# Altium schematic sheet BoardConnectors.SchDoc
size A4; SheetNumber: 3; SheetTotal: 12
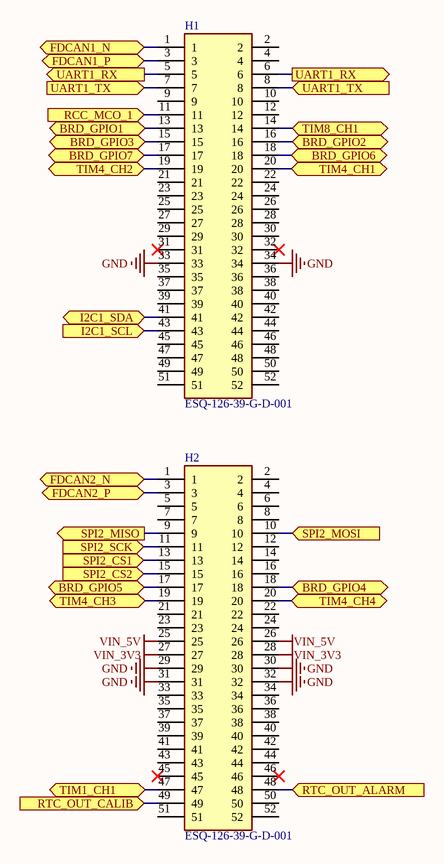
[diagram p0: BoardConnectors.SchDoc]

## Parts
H1  ESQ-126-39-G-D-001  [RHDR52W64P254_2X26_6654X495X1135P]
H2  ESQ-126-39-G-D-001  [RHDR52W64P254_2X26_6654X495X1135P]

## Ports
BRD_GPIO1 (bidir), BRD_GPIO2 (bidir), BRD_GPIO3 (bidir), BRD_GPIO4 (bidir), BRD_GPIO5 (bidir), BRD_GPIO6 (bidir), BRD_GPIO7 (bidir), FDCAN1_N (bidir), FDCAN1_P (bidir), FDCAN2_N (bidir), FDCAN2_P (bidir), I2C1_SCL (in), I2C1_SDA (bidir), RCC_MCO_1 (in), RTC_OUT_ALARM (in), RTC_OUT_CALIB (in), SPI2_CS1 (in), SPI2_CS2 (in), SPI2_MISO (out), SPI2_MOSI (in), SPI2_SCK (in), TIM1_CH1 (bidir), TIM4_CH1 (bidir), TIM4_CH2 (bidir), TIM4_CH3 (bidir), TIM4_CH4 (bidir), TIM8_CH1 (bidir), UART1_RX (out), UART1_TX (in)

## Nets
GND: H1.33 H1.34 H2.29 H2.30 H2.31 H2.32
VIN_3V3: H2.27 H2.28
VIN_5V: H2.25 H2.26
BRD_GPIO1: H1.13 ; port BRD_GPIO1
BRD_GPIO2: H1.16 ; port BRD_GPIO2
BRD_GPIO3: H1.15 ; port BRD_GPIO3
BRD_GPIO4: H2.18 ; port BRD_GPIO4
BRD_GPIO5: H2.17 ; port BRD_GPIO5
BRD_GPIO6: H1.18 ; port BRD_GPIO6
BRD_GPIO7: H1.17 ; port BRD_GPIO7
FDCAN1_N: H1.1 ; port FDCAN1_N
FDCAN1_P: H1.3 ; port FDCAN1_P
FDCAN2_N: H2.1 ; port FDCAN2_N
FDCAN2_P: H2.3 ; port FDCAN2_P
I2C1_SCL: H1.43 ; port I2C1_SCL
I2C1_SDA: H1.41 ; port I2C1_SDA
RCC_MCO_1: H1.11 ; port RCC_MCO_1
RTC_OUT_ALARM: H2.48 ; port RTC_OUT_ALARM
RTC_OUT_CALIB: H2.49 ; port RTC_OUT_CALIB
SPI2_CS1: H2.13 ; port SPI2_CS1
SPI2_CS2: H2.15 ; port SPI2_CS2
SPI2_MISO: H2.9 ; port SPI2_MISO
SPI2_MOSI: H2.10 ; port SPI2_MOSI
SPI2_SCK: H2.11 ; port SPI2_SCK
TIM1_CH1: H2.47 ; port TIM1_CH1
TIM4_CH1: H1.20 ; port TIM4_CH1
TIM4_CH2: H1.19 ; port TIM4_CH2
TIM4_CH3: H2.19 ; port TIM4_CH3
TIM4_CH4: H2.20 ; port TIM4_CH4
TIM8_CH1: H1.14 ; port TIM8_CH1
UART1_RX: H1.5 H1.6 ; port UART1_RX
UART1_TX: H1.7 H1.8 ; port UART1_TX

Not connected (* = marked no-connect by the designer): H1 2 4 9 10 12 21 22 23 24 25 26 27 28 29 30 31* 32* 35 36 37 38 39 40 42 44 45 46 47 48 49 50 51 52; H2 2 4 5 6 7 8 12 14 16 21 22 23 24 33 34 35 36 37 38 39 40 41 42 43 44 45* 46* 50 51 52

## Library data of the parts
H1 H2 = ESQ-126-39-G-D-001: 52 Position Elevated Socket Connector 0.100" (2.54mm) Through Hole Gold; Manufacturer_Name: SAMTEC; Datasheet Link: http://suddendocs.samtec.com/catalog_english/esq_th.pdf; Height: 11.35mm; Manufacturer_Part_Number: ESQ-126-39-G-D-001; Mouser Part Number: 200-ESQ12639GD001; Mouser Price/Stock: https://www.mouser.co.uk/ProductDetail/Samtec/ESQ-126-39-G-D-001?qs=PB6%2FjmICvI2K%2FCIgL4SVbg%3D%3D